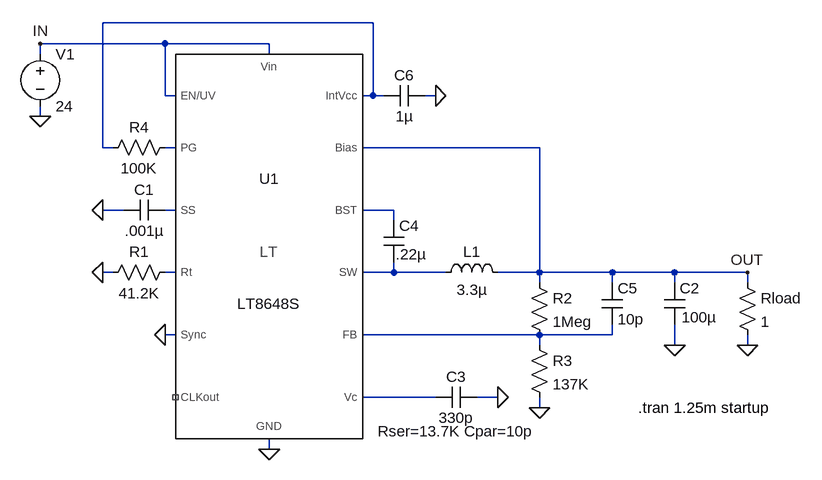
[diagram p0: schematic 8648S.asc]
8648S.asc, the LTspice schematic file:
Version 4
SHEET 1 1528 696
WIRE 448 -160 32 -160
WIRE 128 -128 -64 -128
WIRE 288 -128 128 -128
WIRE -64 -112 -64 -128
WIRE 288 -112 288 -128
WIRE 128 -48 128 -128
WIRE 144 -48 128 -48
WIRE 448 -48 448 -160
WIRE 448 -48 432 -48
WIRE 464 -48 448 -48
WIRE 544 -48 528 -48
WIRE -64 -16 -64 -32
WIRE 32 32 32 -160
WIRE 48 32 32 32
WIRE 144 32 128 32
WIRE 704 32 432 32
WIRE 64 128 32 128
WIRE 144 128 128 128
WIRE 480 128 432 128
WIRE 480 144 480 128
WIRE 48 224 32 224
WIRE 144 224 128 224
WIRE 480 224 480 208
WIRE 480 224 432 224
WIRE 560 224 480 224
WIRE 704 224 704 32
WIRE 704 224 640 224
WIRE 816 224 704 224
WIRE 912 224 816 224
WIRE 1024 224 912 224
WIRE 704 240 704 224
WIRE 816 240 816 224
WIRE 912 240 912 224
WIRE 1024 240 1024 224
WIRE 144 320 128 320
WIRE 704 320 432 320
WIRE 816 320 816 304
WIRE 816 320 704 320
WIRE 704 336 704 320
WIRE 912 336 912 304
WIRE 1024 336 1024 320
WIRE 544 416 432 416
WIRE 640 416 608 416
WIRE 704 432 704 416
WIRE 288 496 288 480
FLAG 32 224 0
FLAG 32 128 0
FLAG -64 -16 0
FLAG 912 336 0
FLAG 704 432 0
FLAG 1024 336 0
FLAG 1024 224 OUT
FLAG -64 -128 IN
FLAG 288 496 0
FLAG 640 416 0
FLAG 128 320 0
FLAG 544 -48 0
SYMBOL res 144 208 R90
WINDOW 0 0 56 VBottom 2
WINDOW 3 32 56 VTop 2
SYMATTR InstName R1
SYMATTR Value 41.2K
SYMBOL cap 128 112 R90
WINDOW 0 0 32 VBottom 2
WINDOW 3 32 32 VTop 2
SYMATTR InstName C1
SYMATTR Value .001µ
SYMBOL voltage -64 -128 R0
SYMATTR InstName V1
SYMATTR Value 24
SYMBOL ind 544 240 R270
WINDOW 0 32 56 VTop 2
WINDOW 3 5 56 VBottom 2
SYMATTR InstName L1
SYMATTR Value 3.3µ
SYMATTR SpiceLine Rser=9m
SYMBOL res 688 224 R0
SYMATTR InstName R2
SYMATTR Value 1Meg
SYMBOL res 688 320 R0
SYMATTR InstName R3
SYMATTR Value 137K
SYMBOL cap 800 240 R0
SYMATTR InstName C5
SYMATTR Value 10p
SYMBOL res 1008 224 R0
SYMATTR InstName Rload
SYMATTR Value 1
SYMBOL cap 896 240 R0
WINDOW 3 27 53 Left 2
SYMATTR Value 100µ
SYMATTR SpiceLine Rser=6m
SYMATTR InstName C2
SYMBOL cap 608 400 R90
WINDOW 0 0 32 VBottom 2
WINDOW 3 32 32 VTop 2
WINDOW 39 53 32 VTop 2
SYMATTR InstName C3
SYMATTR Value 330p
SYMATTR SpiceLine Rser=13.7K Cpar=10p
SYMBOL res 144 16 R90
WINDOW 0 0 56 VBottom 2
WINDOW 3 32 56 VTop 2
SYMATTR InstName R4
SYMATTR Value 100K
SYMBOL cap 464 144 R0
WINDOW 3 19 52 Left 2
SYMATTR Value .22µ
SYMATTR InstName C4
SYMBOL cap 464 -64 M90
WINDOW 0 0 32 VBottom 2
WINDOW 3 32 32 VTop 2
SYMATTR InstName C6
SYMATTR Value 1µ
SYMBOL LT8648S 288 192 R0
SYMATTR InstName U1
TEXT 856 432 Left 2 !.tran 1.25m startup

The netlist it stands for:
* 8648S.asc
R1 N005 0 41.2K
C1 N003 0 .001µ
V1 IN 0 24
L1 N006 OUT 3.3µ Rser=9m
R2 OUT N007 1Meg
R3 N007 0 137K
C5 OUT N007 10p
Rload OUT 0 1
C2 OUT 0 100µ Rser=6m
C3 0 N008 330p Rser=13.7K Cpar=10p
R4 N002 N001 100K
C4 N004 N006 .22µ
C6 N001 0 1µ
XU1 N004 N006 N001 N005 0 N007 N003 N002 N008 IN 0 IN NC_01 OUT LT8648S  ; pins BST SW IntVcc Rt Sync FB SS PG Vc Vin GND EN/UV CLKout Bias
.tran 1.25m startup
.lib LT8648S.sub
.backanno
.end